# EAGLE design deska_uprava (EAGLE 9.3.0)
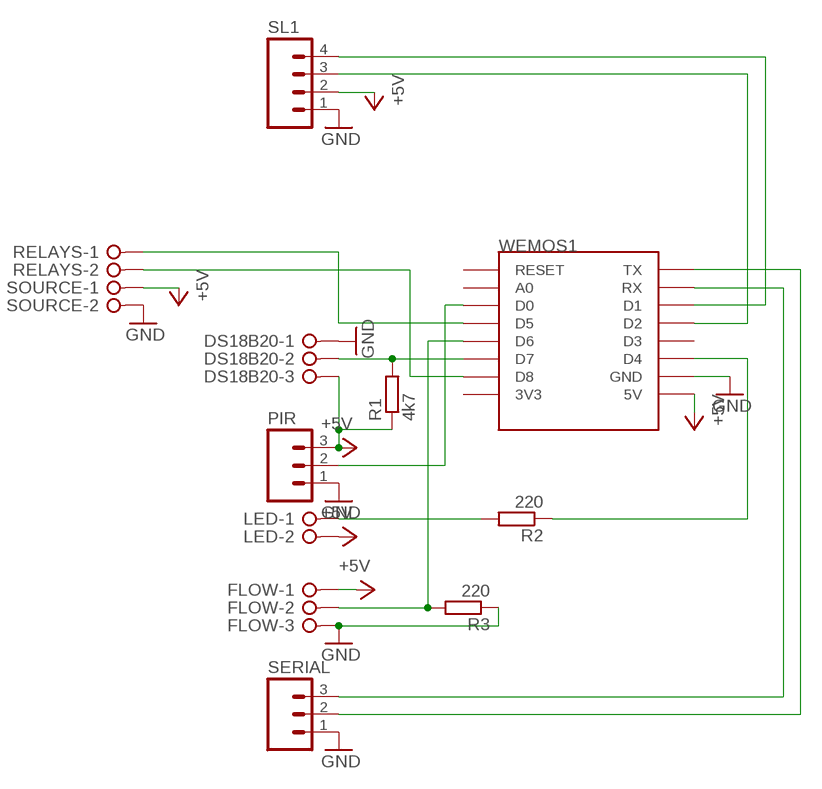
[diagram p0: schematic, sheet 1]

## Parts
DS18B20  W237-03P  [W237-133]
FLOW  W237-03P  [W237-133]
LED  W237-02P  [W237-132]
PIR  M03  [03P]
R1  4k7  R-EU_0207/10  [0207/10]
R2  220  R-EU_0207/10  [0207/10]
R3  220  R-EU_0207/10  [0207/10]
RELAYS  W237-02P  [W237-132]
SERIAL  M03  [03P]
SL1  M04  [04P]
SOURCE  W237-02P  [W237-132]
WEMOS1  WEMOS-D1-MINI  [WEMOS-D1-MINI]

## Nets
+5V: DS18B20.3 FLOW.1 LED.2 PIR.3 R1.1 SL1.2 SOURCE.1 WEMOS1.5V
GND: DS18B20.1 FLOW.3 PIR.1 R3.1 SERIAL.1 SL1.1 SOURCE.2 WEMOS1.GND
N$1: SERIAL.2 WEMOS1.TX
N$2: SERIAL.3 WEMOS1.RX
N$3: SL1.4 WEMOS1.D1
N$4: SL1.3 WEMOS1.D2
N$5: PIR.2 WEMOS1.D0
N$6: R2.1 WEMOS1.D4
N$7: RELAYS.1 WEMOS1.D5
N$8: RELAYS.2 WEMOS1.D8
N$9: DS18B20.2 R1.2 WEMOS1.D7
N$10: FLOW.2 R3.2 WEMOS1.D6
N$12: LED.1 R2.2
Unconnected: WEMOS1.3V3 WEMOS1.A0 WEMOS1.D3 WEMOS1.RESET

## Library data of the parts
DS18B20 FLOW = con-wago-508:W237-03P: WAGO SREW CLAMP; OC_FARNELL: unknown; OC_NEWARK: unknown
LED RELAYS SOURCE = con-wago-508:W237-02P: WAGO SREW CLAMP; OC_FARNELL: unknown; OC_NEWARK: unknown
PIR SERIAL = con-amp-quick:M03: AMP QUICK CONNECTOR; OC_FARNELL: unknown; OC_NEWARK: unknown
R1-R3 = rcl:R-EU_: RESISTOR, European symbol
SL1 = con-amp-quick:M04: AMP QUICK CONNECTOR; OC_FARNELL: unknown; OC_NEWARK: unknown
WEMOS1 = esp8266modules:WEMOS-D1-MINI: WeMos.cc D1 mini ESP8266 module

## Board
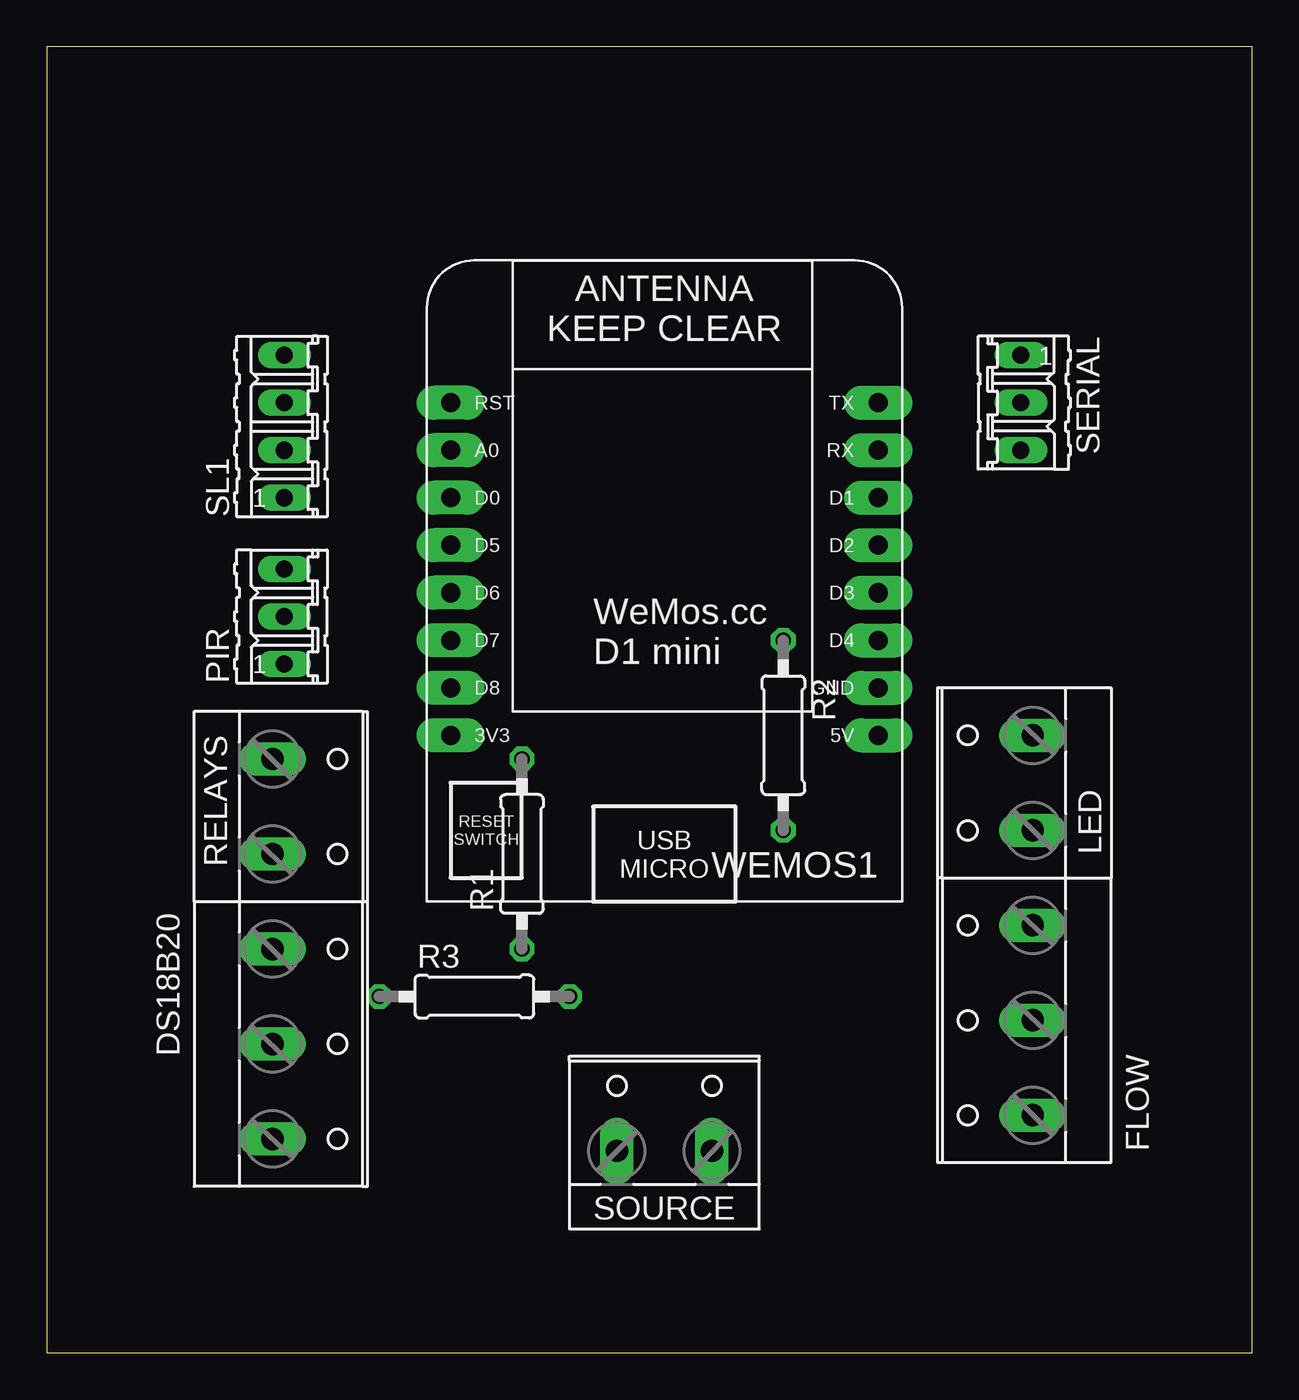
[diagram p1: board, top side]
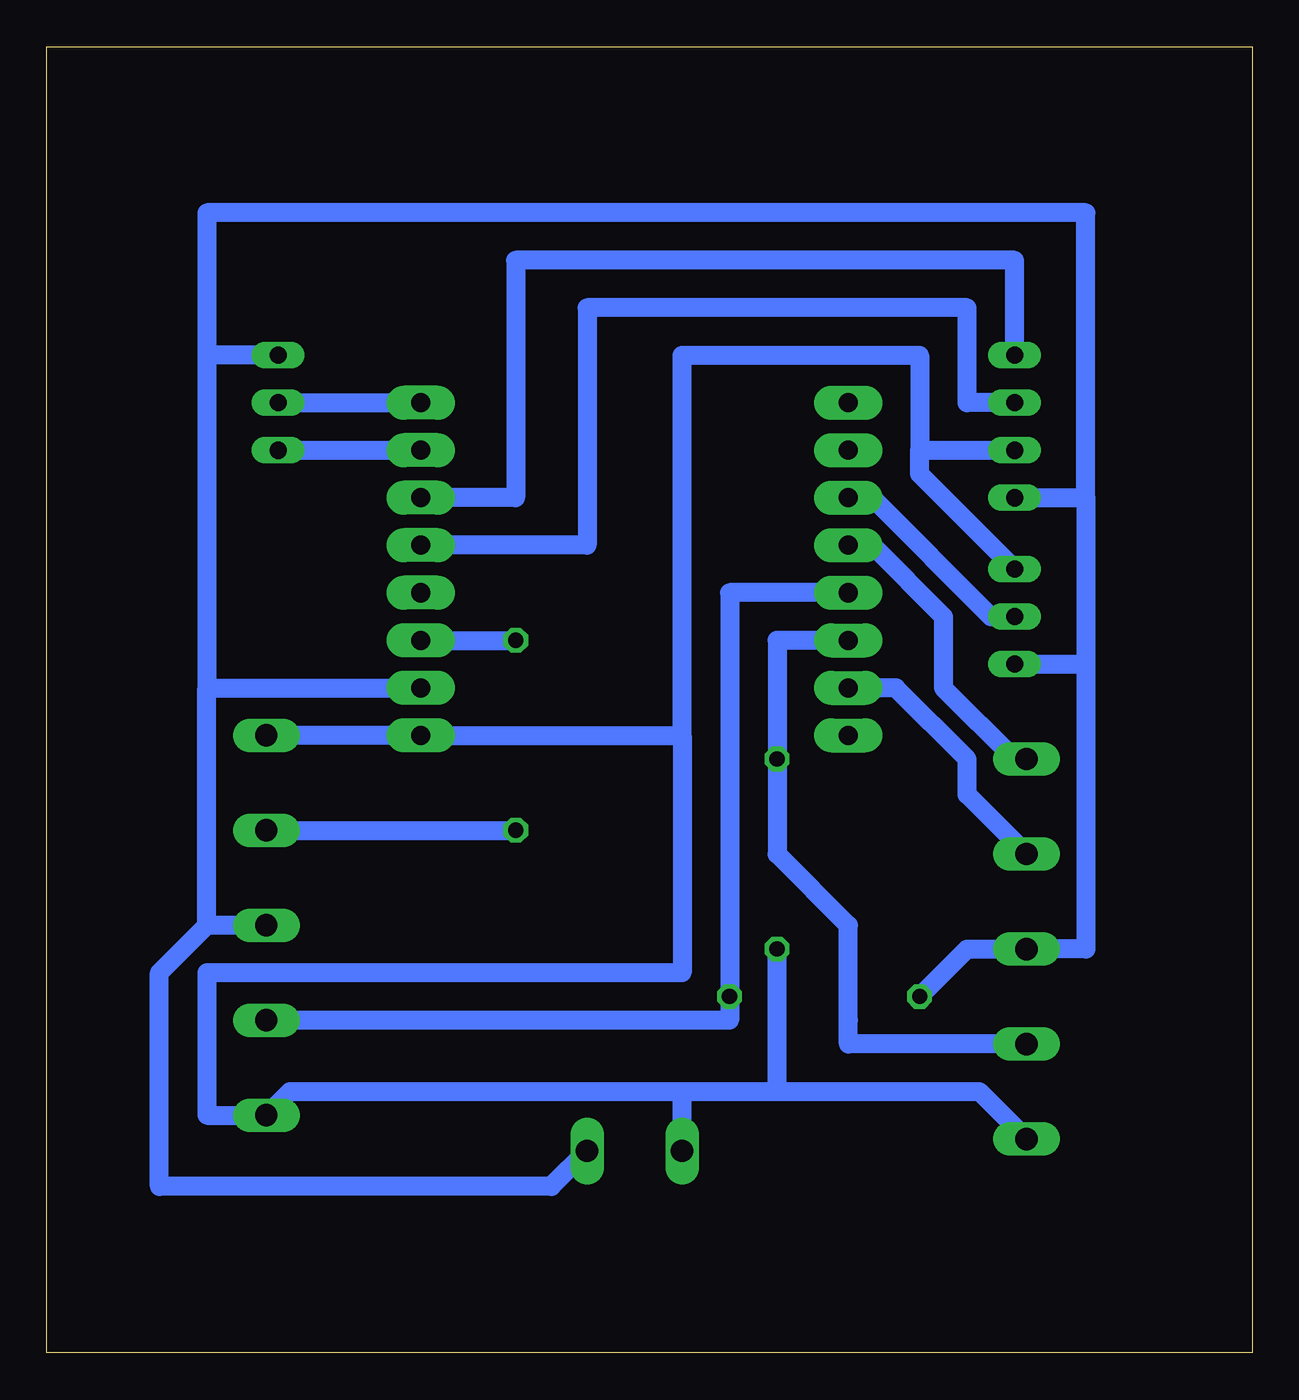
[diagram p2: board, bottom side, seen from below]

Size 64.44 x 69.84 mm. Coordinates in mm from the lower left corner, seen from the top.
Outline: 0,0 64.44,0 64.44,69.84 0,69.84 0,0
Copper layers (1*16): Top 0.035mm / dielectric 1.5mm / Bottom 0.035mm
Design rules "default": minimum track width 10mil, minimum drill 24mil, track to track 8mil, track to pad 8mil, pad to pad 8mil, via to via 8mil, smd to smd 8mil, copper to edge 40mil, drill to drill 8mil, minimum pad ring 10mil, minimum via ring 8mil, stop-mask expansion 4mil, vias tented up to drill 0mil, thermal gap 10mil

### Footprints (pad centres in the part's own frame; a part is rotated, then mirrored left to right if it is on the bottom)
W237-133 = drill 1.194 long: 1 -5.08,-0.635; 2 0,-0.635; 3 5.08,-0.635
W237-132 = drill 1.194 long: 1 -2.54,-0.635; 2 2.54,-0.635
03P = drill 0.914 long: 1 -2.54,0; 2 0,0; 3 2.54,0
0207/10 = drill 0.813 octagon: 1 -5.08,0; 2 5.08,0
04P = drill 0.914 long: 1 -3.81,0; 2 -1.27,0; 3 1.27,0; 4 3.81,0
WEMOS-D1-MINI = drill 1.016 pad 1.829 long: 3V3 -10.16,-10.16; 5V 12.7,-10.16; A0 -10.16,5.08; D0 -10.16,2.54; D1 12.7,2.54; D2 12.7,0; D3 12.7,-2.54; D4 12.7,-5.08; D5 -10.16,0; D6 -10.16,-2.54; D7 -10.16,-5.08; D8 -10.16,-7.62; GND 12.7,-7.62; RESET -10.16,7.62; RX 12.7,5.08; TX 12.7,7.62

### Placement (x,y rotation side)
DS18B20  12.7,16.51 270 top
FLOW  52.07,17.78 90 top
LED  52.07,30.48 90 top
PIR  12.7,39.37 90 top
R1  25.4,26.67 90 top
R2  39.37,33.02 270 top
R3  22.86,19.05 0 top
RELAYS  12.7,29.21 270 top
SERIAL  52.07,50.8 270 top
SL1  12.7,49.53 90 top
SOURCE  33.02,11.43 0 top
WEMOS1  31.75,43.18 0 top

### Tracks (layer width: path | path; a pad name or v marks a point on that pad's centre or on a via)
+5V
  Bottom 1.016: 30.48,33.02 WEMOS1.5V LED.2 | 25.4,13.97 14.61,13.97 DS18B20.3 | 25.4,13.97 R1.1 | 30.48,13.97 51.44,13.97 FLOW.1 55.88,12.7 55.88,20.32 30.48,20.32 30.48,33.02 | 30.48,13.97 25.4,13.97 | 30.48,33.02 30.48,53.34 17.78,53.34 17.78,48.26 | 17.78,48.26 SL1.2 | PIR.3 17.78,46.99 17.78,48.26 | SOURCE.1 30.48,13.97
GND
  Bottom 1.016: 55.88,53.34 55.88,35.56 | FLOW.3 55.88,22.86 | 55.88,22.86 55.88,35.56 | 55.88,35.56 WEMOS1.GND | PIR.1 8.89,36.83 | SERIAL.1 55.88,53.34 | SL1.1 8.89,45.72 | 8.89,45.72 8.89,36.83 | 8.89,45.72 8.89,60.96 55.88,60.96 55.88,53.34 | R3.1 15.24,21.59 DS18B20.1 8.89,21.59 8.89,36.83 | SOURCE.2 37.46,8.89 58.42,8.89 58.42,20.32 55.88,22.86
N$1
  Bottom 1.016: SERIAL.2 WEMOS1.TX
N$2
  Bottom 1.016: SERIAL.3 WEMOS1.RX
N$3
  Bottom 1.016: WEMOS1.D1 39.37,45.72 39.37,58.42 12.7,58.42 SL1.4
N$4
  Bottom 1.016: WEMOS1.D2 35.56,43.18 35.56,55.88 15.24,55.88 15.24,50.8 SL1.3
N$5
  Bottom 1.016: WEMOS1.D0 20.32,45.72 13.97,39.37 PIR.2
N$6
  Bottom 1.016: WEMOS1.D4 R2.1
N$7
  Bottom 1.016: WEMOS1.D5 20.32,43.18 16.51,39.37 16.51,35.56 12.7,31.75 RELAYS.1
N$8
  Bottom 1.016: WEMOS1.D8 19.05,35.56 15.24,31.75 15.24,29.85 RELAYS.2
N$9
  Bottom 1.016: WEMOS1.D7 25.4,38.1 R1.2 25.4,26.67 21.59,22.86 21.59,17.78 21.59,16.51 DS18B20.2
N$10
  Bottom 1.016: FLOW.2 27.94,17.78 R3.2 27.94,40.64 WEMOS1.D6
N$12
  Bottom 1.016: LED.1 R2.2